# Altium schematic sheet sgnd_rings.SchDoc
size 431 x 279 mm; SheetNumber: 1; SheetTotal: 3
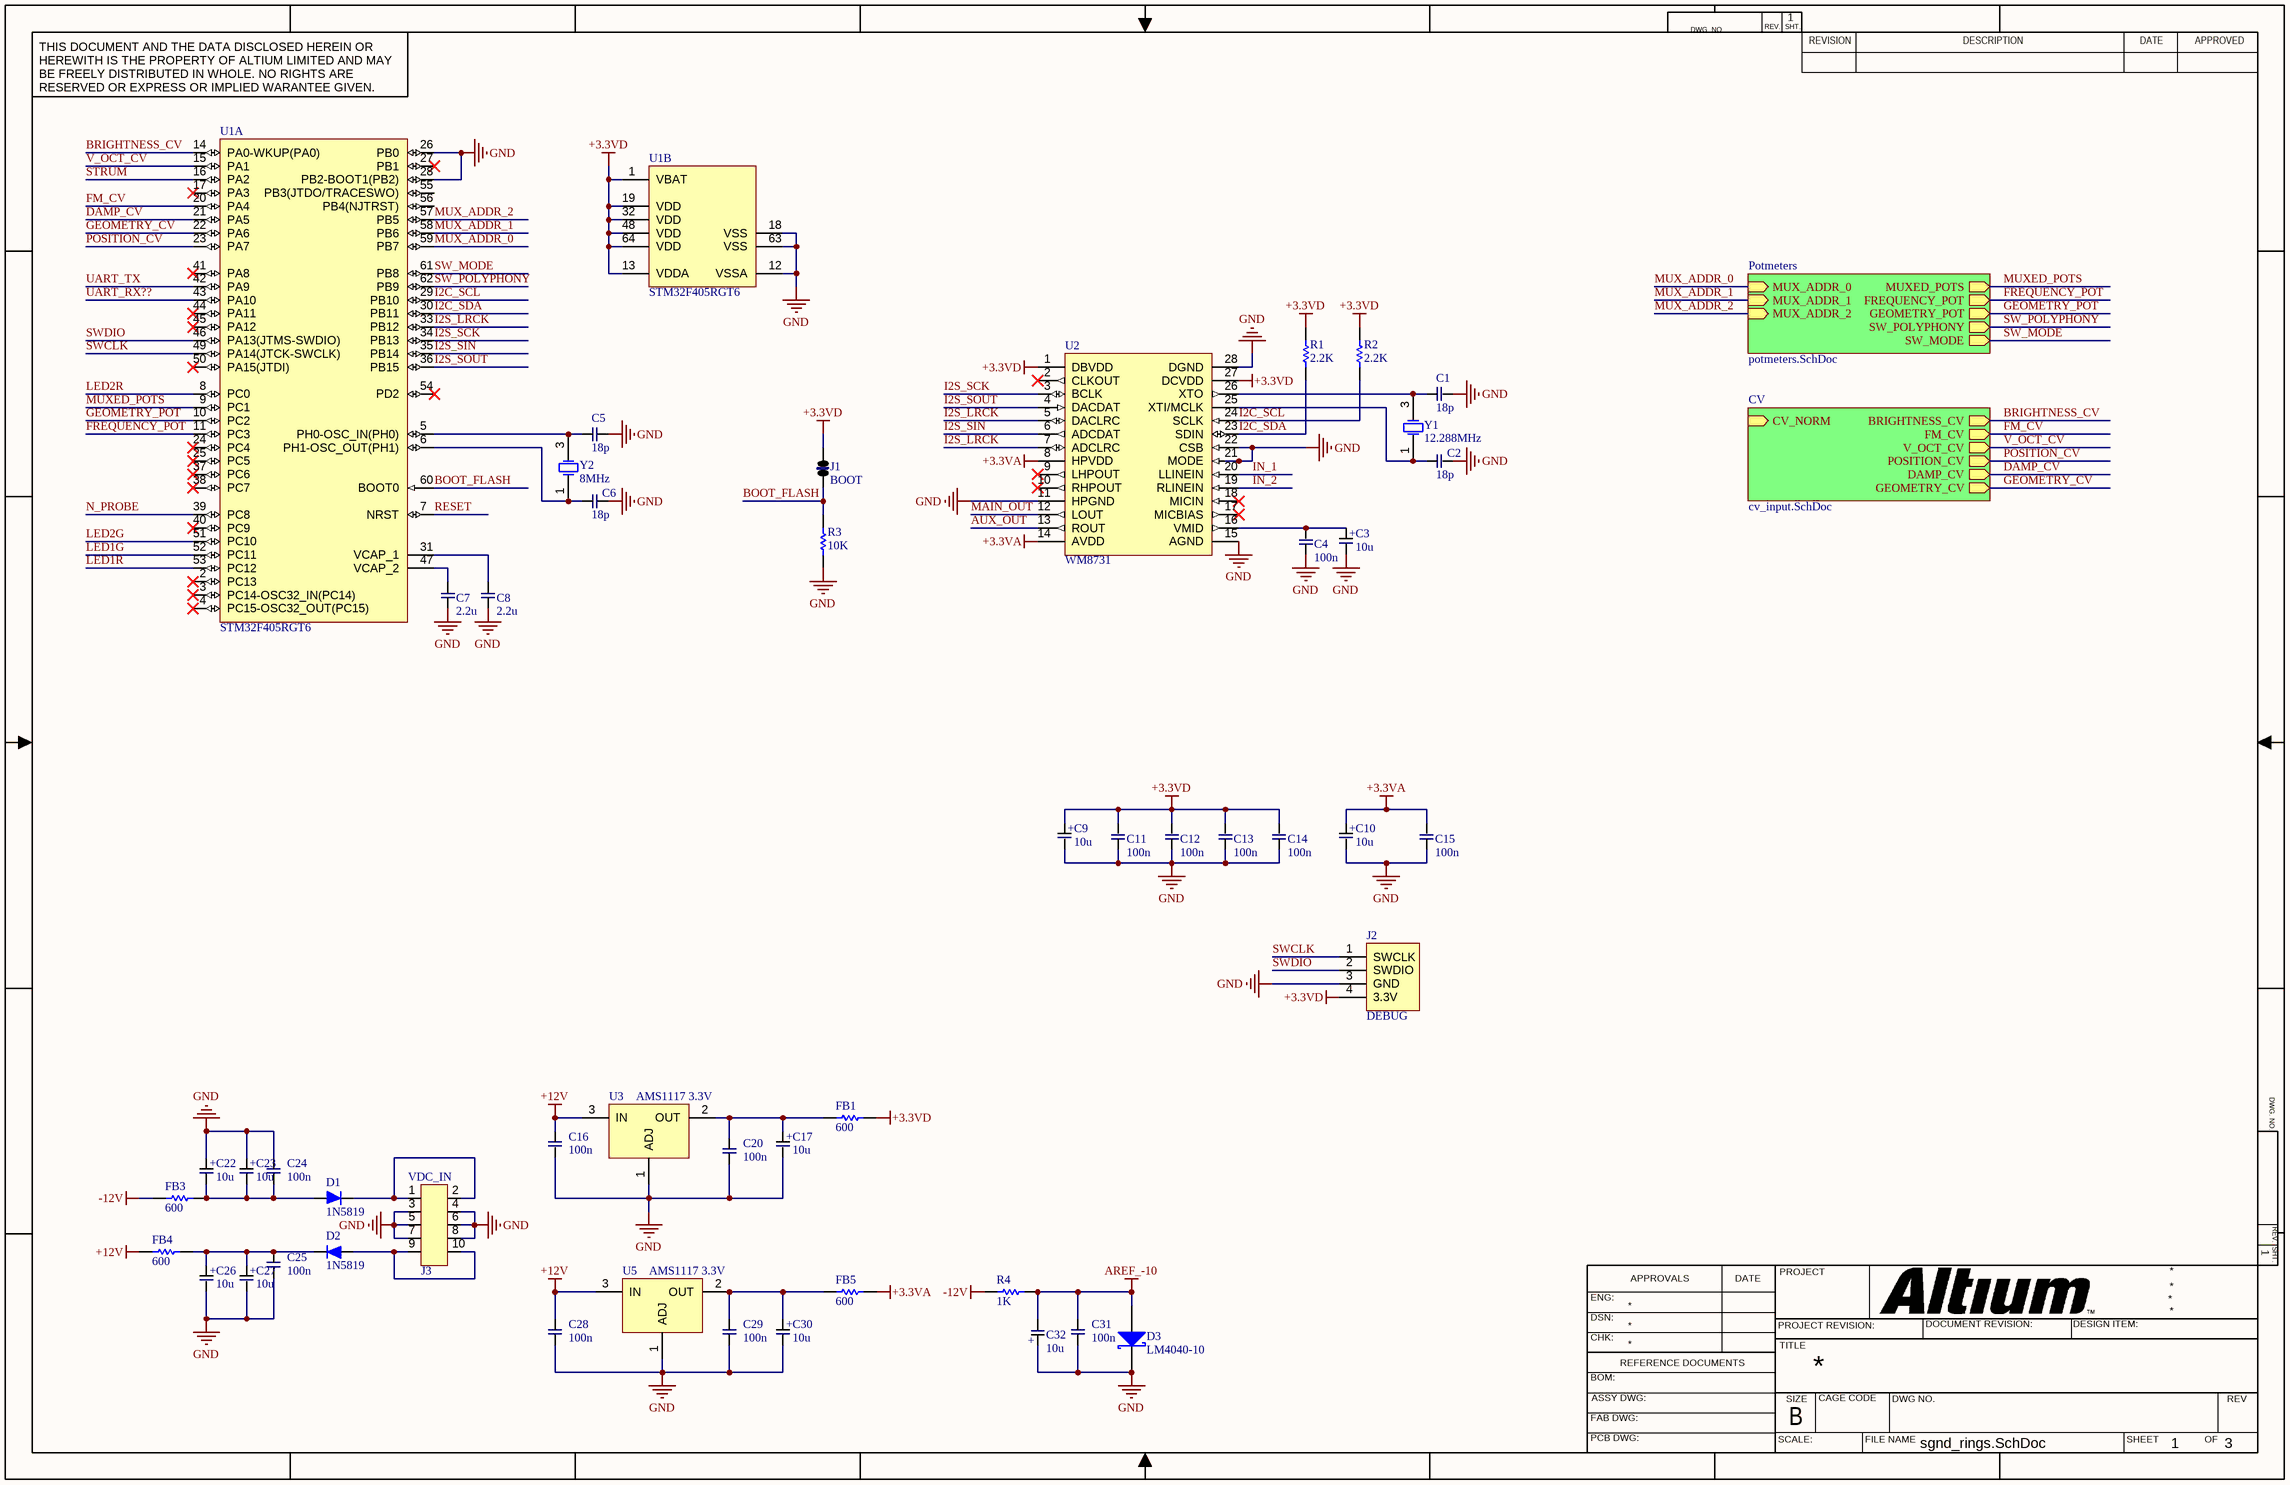
[diagram p0: sgnd_rings.SchDoc]

## Parts
C1  value 18p  [C0603]  (hidden comment: Capacitor)
C2  value 18p  [C0603]  (hidden comment: Capacitor)
C3  value 10u  [ELCO_SMD_4x5.3mm]  (hidden comment: C_ELCO)
C4  value 100n  [C0603]  (hidden comment: Capacitor)
C5  value 18p  [C0603]  (hidden comment: Capacitor)
C6  value 18p  [C0603]  (hidden comment: Capacitor)
C7  value 2.2u  [C0603]  (hidden comment: Capacitor)
C8  value 2.2u  [C0603]  (hidden comment: Capacitor)
C9  value 10u  [ELCO_SMD_4x5.3mm]  (hidden comment: C_ELCO)
C10  value 10u  [ELCO_SMD_4x5.3mm]  (hidden comment: C_ELCO)
C11  value 100n  [C0603]  (hidden comment: Capacitor)
C12  value 100n  [C0603]  (hidden comment: Capacitor)
C13  value 100n  [C0603]  (hidden comment: Capacitor)
C14  value 100n  [C0603]  (hidden comment: Capacitor)
C15  value 100n  [C0603]  (hidden comment: Capacitor)
C16  value 100n  [C0603]  (hidden comment: Capacitor)
C17  value 10u  [ELCO_SMD_4x5.3mm]  (hidden comment: C_ELCO)
C20  value 100n  [C0603]  (hidden comment: Capacitor)
C22  value 10u  [ELCO_SMD_4x5.3mm]  (hidden comment: C_ELCO)
C23  value 10u  [ELCO_SMD_4x5.3mm]  (hidden comment: C_ELCO)
C24  value 100n  [C0603]  (hidden comment: Capacitor)
C25  value 100n  [C0603]  (hidden comment: Capacitor)
C26  value 10u  [ELCO_SMD_4x5.3mm]  (hidden comment: C_ELCO)
C27  value 10u  [ELCO_SMD_4x5.3mm]  (hidden comment: C_ELCO)
C28  value 100n  [C0603]  (hidden comment: Capacitor)
C29  value 100n  [C0603]  (hidden comment: Capacitor)
C30  value 10u  [ELCO_SMD_4x5.3mm]  (hidden comment: C_ELCO)
C31  value 100n  [C0603]  (hidden comment: Capacitor)
C32  value 10u  [ELCO_SMD_4x5.3mm]  (hidden comment: C_ELCO)
D1  value 1N5819  [DIODE_SOD-123]  (hidden comment: 1N4148)
D2  value 1N5819  [DIODE_SOD-123]  (hidden comment: 1N4148)
D3  LM4040-10  [SOT-23_M]
FB1  value 600  [R0603]  (hidden comment: RESISTOR)
FB3  value 600  [R0603]  (hidden comment: RESISTOR)
FB4  value 600  [R0603]  (hidden comment: RESISTOR)
FB5  value 600  [R0603]  (hidden comment: RESISTOR)
J1  BOOT  [JUMPER_2.54]
J2  DEBUG  [4PIN_CONNECTOR_VERTICAL_1,25MM_P - duplicate]
J3  IDC_socket_10pin  [IDC10]  (value not drawn)
R1  value 2.2K  [R0603]  (hidden comment: RESISTOR)
R2  value 2.2K  [R0603]  (hidden comment: RESISTOR)
R3  value 10K  [R0603]  (hidden comment: RESISTOR)
R4  value 1K  [R0603]  (hidden comment: RESISTOR)
U1  STM32F405RGT6  [STM-LQFP64_N]  (parts A,B of 2)
U2  WM8731  [SSOP-28_L]
U3  value AMS1117 3.3V  [SOT223]  (hidden comment: AMS1117_5V)
U5  value AMS1117 3.3V  [SOT223]  (hidden comment: AMS1117_5V)
Y1  12.288MHz  [XTAL_SMD_3.2x2.5x0.8]
Y2  8MHz  [XTAL_SMD_3.2x2.5x0.8]

## Sub-sheets
CV = cv_input.SchDoc: BRIGHTNESS_CV (out), FM_CV (out), V_OCT_CV (out), POSITION_CV (out), DAMP_CV (out), GEOMETRY_CV (out), CV_NORM (in)
Potmeters = potmeters.SchDoc: MUX_ADDR_0 (in), MUX_ADDR_1 (in), MUX_ADDR_2 (in), MUXED_POTS (out), FREQUENCY_POT (out), GEOMETRY_POT (out), SW_POLYPHONY (out), SW_MODE (out)

## Nets
+3.3VA: C10.1(+) C15.2 FB5.1 U2.8(HPVDD) U2.14(AVDD)
+3.3VD: C9.1(+) C11.2 C12.2 C13.2 C14.2 FB1.1 J1.2(C2) J2.4(3.3V) R1.2 R2.2 U1.1(VBAT) U1.13(VDDA) U1.19(VDD) U1.32(VDD) U1.48(VDD) U1.64(VDD) U2.1(DBVDD) U2.27(DCVDD)
+12V: C16.1 C28.1 FB4.2 U3.3(IN) U5.3(IN)
-12V: FB3.2 R4.2
AREF_-10: C31.1 C32.2(-) D3.2(-) R4.1
GND: C1.2 C2.2 C3.2(-) C4.1 C5.2 C6.2 C7.1 C8.1 C9.2(-) C10.2(-) C11.1 C12.1 C13.1 C14.1 C15.1 C16.2 C17.2(-) C20.2 C22.1(+) C23.1(+) C24.1 C25.2 C26.2(-) C27.2(-) C28.2 C29.2 C30.2(-) C31.2 C32.1(+) D3.1(+) J2.3(GND) J3.3 J3.4 J3.5 J3.6 J3.7 J3.8 R3.1 U1.12(VSSA) U1.18(VSS) U1.26(PB0) U1.28(PB2-BOOT1(PB2)) U1.63(VSS) U2.11(HPGND) U2.15(AGND) U2.21(MODE) U2.22(CSB) U2.28(DGND) U3.1(ADJ) U5.1(ADJ)
AUX_OUT: U2.13(ROUT)
BOOT_FLASH: J1.1(C1) R3.2 U1.60(BOOT0)
BRIGHTNESS_CV: U1.14(PA0-WKUP(PA0)) ; sheet CV/BRIGHTNESS_CV
DAMP_CV: U1.21(PA5) ; sheet CV/DAMP_CV
FM_CV: U1.20(PA4) ; sheet CV/FM_CV
FREQUENCY_POT: U1.11(PC3) ; sheet Potmeters/FREQUENCY_POT
GEOMETRY_CV: U1.22(PA6) ; sheet CV/GEOMETRY_CV
GEOMETRY_POT: U1.10(PC2) ; sheet Potmeters/GEOMETRY_POT
I2C_SCL: R2.1 U1.29(PB10) U2.24(SCLK)
I2C_SDA: R1.1 U1.30(PB11) U2.23(SDIN)
I2S_LRCK: U1.33(PB12) U2.5(DACLRC) U2.7(ADCLRC)
I2S_SCK: U1.34(PB13) U2.3(BCLK)
I2S_SIN: U1.35(PB14) U2.6(ADCDAT)
I2S_SOUT: U1.36(PB15) U2.4(DACDAT)
IN_1: U2.20(LLINEIN)
IN_2: U2.19(RLINEIN)
LED1G: U1.52(PC11)
LED1R: U1.53(PC12)
LED2G: U1.51(PC10)
LED2R: U1.8(PC0)
MAIN_OUT: U2.12(LOUT)
MUX_ADDR_0: U1.59(PB7) ; sheet Potmeters/MUX_ADDR_0
MUX_ADDR_1: U1.58(PB6) ; sheet Potmeters/MUX_ADDR_1
MUX_ADDR_2: U1.57(PB5) ; sheet Potmeters/MUX_ADDR_2
MUXED_POTS: U1.9(PC1) ; sheet Potmeters/MUXED_POTS
N_PROBE: U1.39(PC8)
POSITION_CV: U1.23(PA7) ; sheet CV/POSITION_CV
RESET: U1.7(NRST)
STRUM: U1.16(PA2)
SW_MODE: U1.61(PB8) ; sheet Potmeters/SW_MODE
SW_POLYPHONY: U1.62(PB9) ; sheet Potmeters/SW_POLYPHONY
SWCLK: J2.1(SWCLK) U1.49(PA14(JTCK-SWCLK))
SWDIO: J2.2(SWDIO) U1.46(PA13(JTMS-SWDIO))
UART_RX??: U1.43(PA10)
UART_TX: U1.42(PA9)
V_OCT_CV: U1.15(PA1) ; sheet CV/V_OCT_CV
NetC1_1: C1.1 U2.26(XTO) Y1.3(OSC2)
NetC2_1: C2.1 U2.25(XTI/MCLK) Y1.1(OSC1)
NetC3_1: C3.1(+) C4.2 U2.16(VMID)
NetC5_1: C5.1 U1.5(PH0-OSC_IN(PH0)) Y2.3(OSC2)
NetC6_1: C6.1 U1.6(PH1-OSC_OUT(PH1)) Y2.1(OSC1)
NetC7_2: C7.2 U1.47(VCAP_2)
NetC8_2: C8.2 U1.31(VCAP_1)
NetC17_1: C17.1(+) C20.1 FB1.2 U3.2(OUT)
NetC22_2: C22.2(-) C23.2(-) C24.2 D1.2(A) FB3.1
NetC25_1: C25.1 C26.1(+) C27.1(+) D2.1(K) FB4.1
NetC29_1: C29.1 C30.1(+) FB5.2 U5.2(OUT)
NetD1_1: D1.1(K) J3.1 J3.2
NetD2_2: D2.2(A) J3.9 J3.10

Not connected (* = marked no-connect by the designer): U1 2(PC13)* 3(PC14-OSC32_IN(PC14))* 4(PC15-OSC32_OUT(PC15))* 17(PA3)* 24(PC4)* 25(PC5)* 27(PB1)* 37(PC6)* 38(PC7)* 40(PC9)* 41(PA8)* 44(PA11)* 45(PA12)* 50(PA15(JTDI))* 54(PD2)* 55(PB3(JTDO/TRACESWO)) 56(PB4(NJTRST)); U2 2(CLKOUT)* 9(LHPOUT)* 10(RHPOUT)* 17(MICBIAS)* 18(MICIN)*

## Notes on the sheet
- (near J3) VDC_IN
- DWG. NO.
- REV.
- SHT.
- THIS DOCUMENT AND THE DATA DISCLOSED HEREIN OR HEREWITH IS THE PROPERTY OF ALTIUM LIMITED AND MAY BE FREELY DISTRIBUTED IN WHOLE. NO RIGHTS ARE RESERVED OR EXPRESS OR IMPLIED WARANTEE GIVEN.
- REVISION
- DESCRIPTION
- DATE
- APPROVED
- ENG:
- APPROVALS
- PROJECT
- DSN:
- CHK:
- REFERENCE DOCUMENTS
- PROJECT REVISION:
- TITLE
- DOCUMENT REVISION:
- DESIGN ITEM:
- BOM:
- FAB DWG:
- PCB DWG:
- ASSY DWG:
- SCALE:
- SIZE
- B
- CAGE CODE
- FILE NAME
- DWG NO.
- SHEET
- OF
- REV

## Library data of the parts
C1 C2 C4-C8 C11-C16 C20 C24 C25 C28 C29 C31 = Capacitor: Capacitor (Semiconductor SIM Model); Published: 8-Jun-2000; LatestRevisionDate: 29-May-2009; LatestRevisionNote: IPC-7351 Footprint Added.; PackageReference: C1206; Publisher: Altium Limited; PackageDescription: Chip Capacitor
D1 D2 = 1N5819: 1 Amp General Purpose Rectifier; Published: 8-Jun-2000; LatestRevisionDate: 17-Jul-2002; LatestRevisionNote: Re-released for DXP Platform.; DatasheetVersion: 1998; PackageVersion: Aug-1999; PackageReference: DO-41; Publisher: Altium Limited; PackageDescription: Diode, Axial; Body 5.2 x 2.7 mm (LxDia. max), Lead Dia. 0.86 mm (max); Code_JEDEC: DO-204-AL
D3 = LM4040-10: LM4040 Precision Micropower Shunt Voltage Reference 10V; Value: LM4040-10; JLC Part Number: C201738
J1 = Jumper: Jumper Wire; Published: 24-Mar-1999; LatestRevisionDate: 17-Jul-2002; LatestRevisionNote: Re-released for DXP Platform.; PackageReference: RAD-0.2; Publisher: Altium Limited; PackageDescription: Radial Cap, Thru-Hole; 2 Leads; 0.2 in Pin Spacing
J2 = STM32_SWD_PROGRAMMER: Value: STM32_SWD_PROGRAMMER
J3 = IDC_socket_10pin: Value: IDC10 socket
U1 = STM32F405RGT6: ARM Cortex-M4 32-bit MCU+FPU, 210 DMIPS, 1024 kB Flash, 192 kB Internal RAM, 51 I/Os, 64-pin LQFP, -40 to 85 degC, Tray; Manufacturer: STMicroelectronics; D/A Converter: 2x12-bit; FLASH Size (Prog) (kB): 1024; I/Os (High Current): 51; Internal RAM Size (kB): 192; Operating Frequency(F) (Processor speed) (MHz): 168; Supply Voltage(Vcc) max (V): 3.6; Supply Voltage(Vcc) min (V): 1.8; DatasheetVersion: Rev. 4; PackageVersion: Rev. 4, 06/2013; PackageReference: LQFP64; PackageDescription: 64-Pin Low Profile Quad Flat Package, 10 x 10 mm Body, 0.5 mm Pitch; Supplier 1: Digi-Key; Supplier Part Number 1: 497-11767-ND; Supplier 2: Farnell; Supplier Part Number 2: 2064363; Supplier 3: Newark; Supplier Part Number 3: 73T2329; Supplier 4: Mouser; Supplier Part Number 4: 511-STM32F405RGT6; Core: ARM Cortex-M4; Packing: Tray; Mounting Technology: Surface Mount; PartNumber: STM32F405RGT6; ComponentLink1Description: Manufacturer URL; ComponentLink1URL: http://www.st.com/web/en/home.html; ComponentLink2Description: Datasheet; ComponentLink2URL: http://www.st.com/st-web-ui/static/active/en/resource/technical/document/datasheet/DM00037051.pdf; ComponentLink3Description: Package Specification; ComponentLink3URL: http://www.st.com/st-web-ui/static/active/en/resource/technical/document/datasheet/DM00037051.pdf
U2 = WM8731: Portable Internet Audio CODEC with Headphone Driver / and Programmable Sample Rates; Manufacturer: Microchip; PartNumber: MCP4822-E/P; DatasheetVersion: revA, Apr-2010; PackageVersion: revBB, Aug-2009; PackageReference: PDIP300-P8; PackageDescription: 8-Lead Plastic Dual In-Line (P) - 300 mil Body [PDIP]; Supplier 1: Digi-Key; Supplier Part Number 1: MCP4822-E/P-ND; Supplier 2: Farnell; Supplier Part Number 2: 1439413; Supplier 3: Newark; Supplier Part Number 3: 11M1705; Supplier 4: Mouser; Supplier Part Number 4: 579-MCP4822-E/P; Mounting Technology: Through Hole; Code_JEDEC: MS-001; Value: WM8731
Y1 Y2 = XTAL_3225-24.576M-SR: Crystal Oscillator; Value: XTAL; Published: 8-Jun-2000; LatestRevisionDate: 17-Jul-2002; LatestRevisionNote: Re-released for DXP Platform.; PackageReference: R38; Publisher: Altium Limited; PackageDescription: Crystal, Thru-Hole; 2 Leads; Body 3.1 x 8.2 mm (Dia.xH)
FB1 FB3-FB5 R1-R4 = RESISTOR: Published: 8-Jun-2000; LatestRevisionDate: 17-Jul-2002; LatestRevisionNote: Re-released for DXP Platform.; PackageReference: AXIAL-0.3; Publisher: Altium Limited; PackageDescription: Axial Device, Thru-Hole; 2 Leads; 0.3 in Pin Spacing